# EAGLE schematic TFT_ENCODER_CIRCUIT (EAGLE 9.6.2)
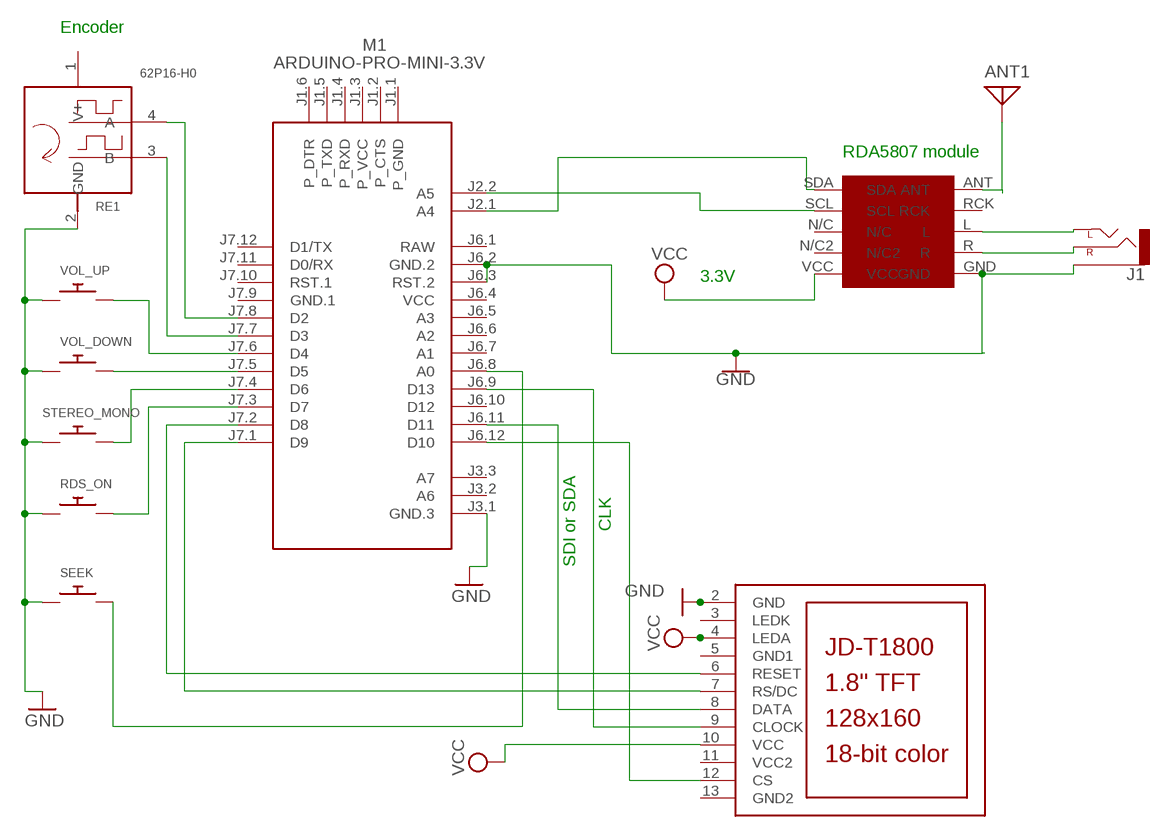
[diagram p0: schematic, sheet 1]

## Parts
ANT1  ANTENNA  [PAD-01]
J1  AUDIO_JACK_2.5MMSPECIAL_POGO_PINS  [STEREOJACK2.5MM_SPECIAL_POGOPINS]
LCD1  JD-T1800  [JD-T1800]
M1  ARDUINO-PRO-MINI-3.3V  [ARDUINO-PRO-MINI]
RDS_ON  SWITCH_PUSHBUTTONC&K_KSS  [BTN_CK_KSS]
RE1  62P16-H0  [62P]
SEEK  SWITCH_PUSHBUTTONC&K_KSS  [BTN_CK_KSS]
STEREO_MONO  SWITCH_PUSHBUTTONC&K_KSS  [BTN_CK_KSS]
U$1  RDA  [RDA]
VOL_DOWN  SWITCH_PUSHBUTTONC&K_KSS  [BTN_CK_KSS]
VOL_UP  SWITCH_PUSHBUTTONC&K_KSS  [BTN_CK_KSS]

## Nets
GND: J1.RING1(SLEEVE) LCD1.2(GND) M1.J3.1(GND.3) M1.J6.2(GND.2) M1.J6.3(RST.2) RDS_ON.P$1 RE1.2(GND) SEEK.P$1 STEREO_MONO.P$1 U$1.GND VOL_DOWN.P$1 VOL_UP.P$1
N$1: M1.J2.2(A5) U$1.SCL
N$2: M1.J2.1(A4) U$1.SDA
N$3: J1.SHIELD(LEFT) U$1.L
N$4: J1.TIP(RIGHT) U$1.R
N$5: ANT1.1 U$1.ANT
N$6: M1.J7.7(D3) RE1.3(B)
N$7: M1.J7.8(D2) RE1.4(A)
N$8: M1.J7.6(D4) VOL_UP.P$2
N$9: M1.J7.5(D5) VOL_DOWN.P$2
N$10: M1.J7.4(D6) STEREO_MONO.P$2
N$11: M1.J7.3(D7) RDS_ON.P$2
N$12: LCD1.6(RESET) M1.J7.2(D8)
N$13: LCD1.7(RS/DC) M1.J7.1(D9)
N$14: LCD1.8(DATA) M1.J6.11(D11)
N$15: LCD1.9(CLOCK) M1.J6.9(D13)
N$16: LCD1.12(CS) M1.J6.12(D10)
N$17: M1.J6.8(A0) SEEK.P$2
VCC: LCD1.4(LEDA) LCD1.10(VCC) U$1.VCC
Unconnected: LCD1.3(LEDK) M1.J1.1(P_GND) M1.J1.2(P_CTS) M1.J1.3(P_VCC) M1.J1.4(P_RXD) M1.J1.5(P_TXD) M1.J1.6(P_DTR) M1.J3.2(A6) M1.J3.3(A7) M1.J6.5(A3) M1.J6.6(A2) M1.J6.7(A1) M1.J6.10(D12) M1.J7.10(RST.1) M1.J7.11(D0/RX) M1.J7.12(D1/TX) RE1.1(V+) U$1.N/C U$1.N/C2 U$1.RCK

## Notes on the sheet
- Encoder
- RDA5807 module
- 3.3V
- CLK
- SDI or SDA

## Power pins joined to a net without a drawn wire
GND1: LCD1.5(GND1)
GND2: LCD1.13(GND2)
GND.1: M1.J7.9(GND.1)
RAW: M1.J6.1(RAW)
VCC: M1.J6.4(VCC)
VCC2: LCD1.11(VCC2)

## Library data of the parts
ANT1 = discrete:ANTENNA: Antenna
J1 = SparkFun-Connectors:AUDIO_JACK_2.5MM: Audio Jack 2.5mm variants of PTH and SMT audio jacks. SparkFun Products: SparkFun PicoBoard <https://www.sparkfun.com/products/11888>- 2.5mm SMD
LCD1 = adafruit:JD-T1800
M1 = diy-modules:ARDUINO-PRO-MINI-*: Arduino Pro Mini and compatible devices More details available here: https://www.arduino.cc/en/Main/ArduinoBoardProMini Click here to find device on ebay.com <http://www.ebay.com/sch/arduino+pro+mini>
RDS_ON SEEK STEREO_MONO VOL_DOWN VOL_UP = adafruit:SWITCH_PUSHBUTTON: Buttons SOFTTOUCHSMD_SJ - Soft touch temporary push button (Super Junk Akihabara) Compatible with SKPMANE010 [Mouser: 688-SKPMAN] C&K_KSS = Digikey: KSS221GLFS
RE1 = rotary-encoder:62P*0
U$1 = RDA:RDA